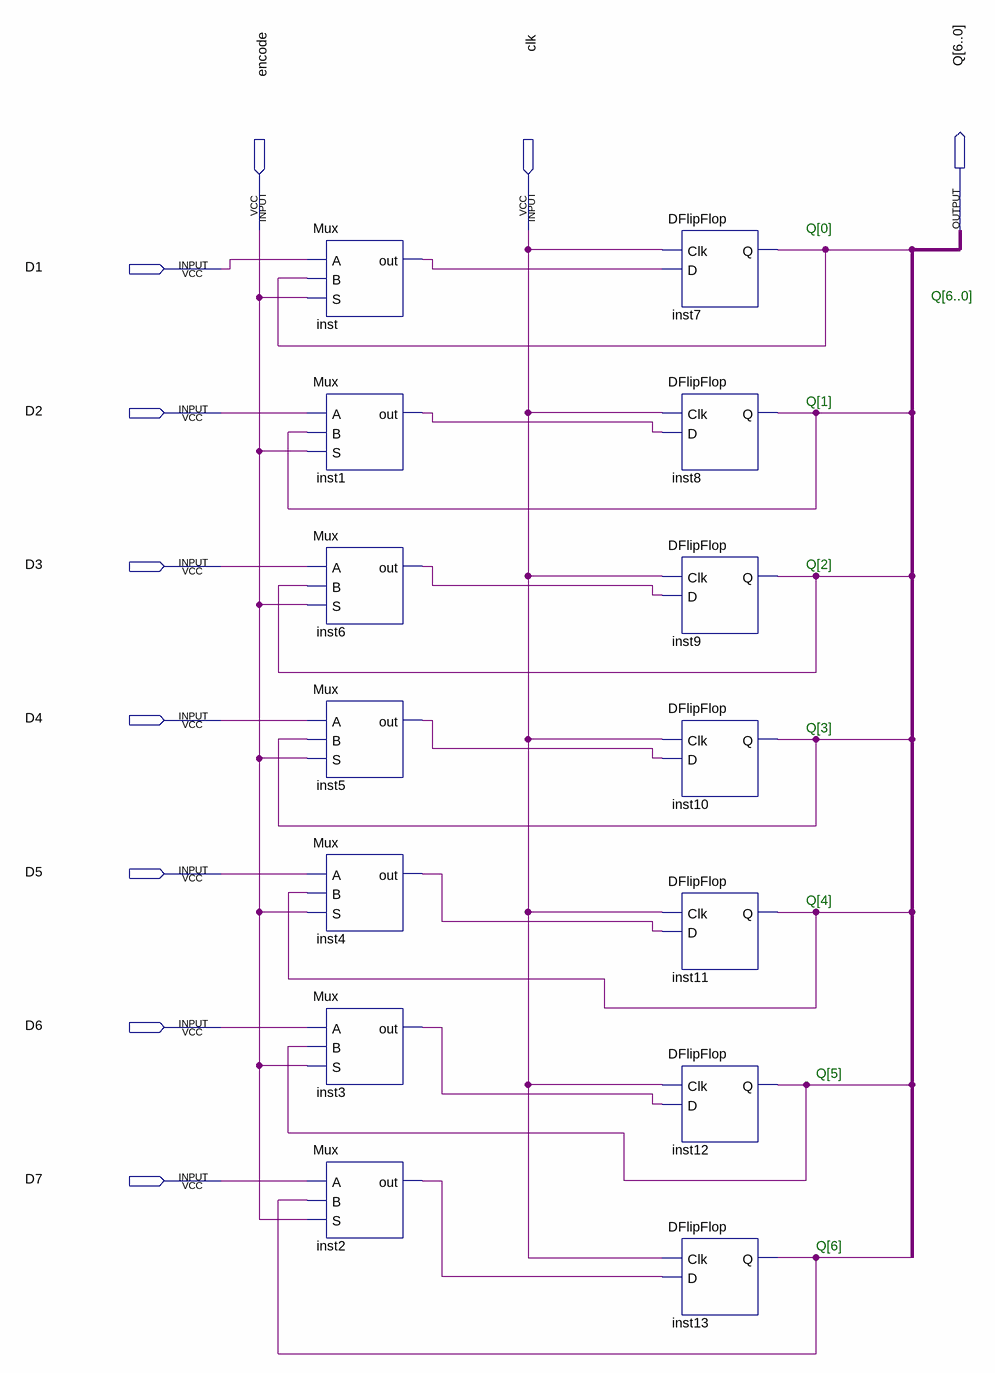
[diagram p0: schematic sheet]
// Quartus schematic Memory.bdf as structural Verilog: 14 symbols, 10 pins
module Memory (
  input  encode,
  input  clk,
  input  D1,
  input  D2,
  input  D3,
  input  D4,
  input  D5,
  input  D6,
  input  D7,
  output [6:0] Q
);

  wire inst1_out, inst2_out, inst3_out, inst4_out, inst5_out, inst6_out, inst7_q, inst8_q, inst9_q, inst10_q,
       inst11_q, inst12_q, inst13_q, inst_out;

  Mux inst (.A(D1), .B(inst7_q), .S(encode), .out(inst_out));
  Mux inst1 (.A(D2), .B(inst8_q), .S(encode), .out(inst1_out));
  Mux inst6 (.A(D3), .B(inst9_q), .S(encode), .out(inst6_out));
  Mux inst5 (.A(D4), .B(inst10_q), .S(encode), .out(inst5_out));
  Mux inst4 (.A(D5), .B(inst11_q), .S(encode), .out(inst4_out));
  Mux inst3 (.A(D6), .B(inst12_q), .S(encode), .out(inst3_out));
  Mux inst2 (.A(D7), .B(inst13_q), .S(encode), .out(inst2_out));
  DFlipFlop inst7 (.Clk(clk), .D(inst_out), .Q(inst7_q));
  DFlipFlop inst8 (.Clk(clk), .D(inst1_out), .Q(inst8_q));
  DFlipFlop inst9 (.Clk(clk), .D(inst6_out), .Q(inst9_q));
  DFlipFlop inst10 (.Clk(clk), .D(inst5_out), .Q(inst10_q));
  DFlipFlop inst11 (.Clk(clk), .D(inst4_out), .Q(inst11_q));
  DFlipFlop inst12 (.Clk(clk), .D(inst3_out), .Q(inst12_q));
  DFlipFlop inst13 (.Clk(clk), .D(inst2_out), .Q(inst13_q));

  // Notes on the sheet:
  //   Q[0]
  //   Q[6..0]
  //   Q[1]
  //   Q[2]
  //   Q[3]
  //   Q[4]
  //   Q[5]
  //   Q[6]
endmodule
